# Altium project single channel esc.PrjPcb
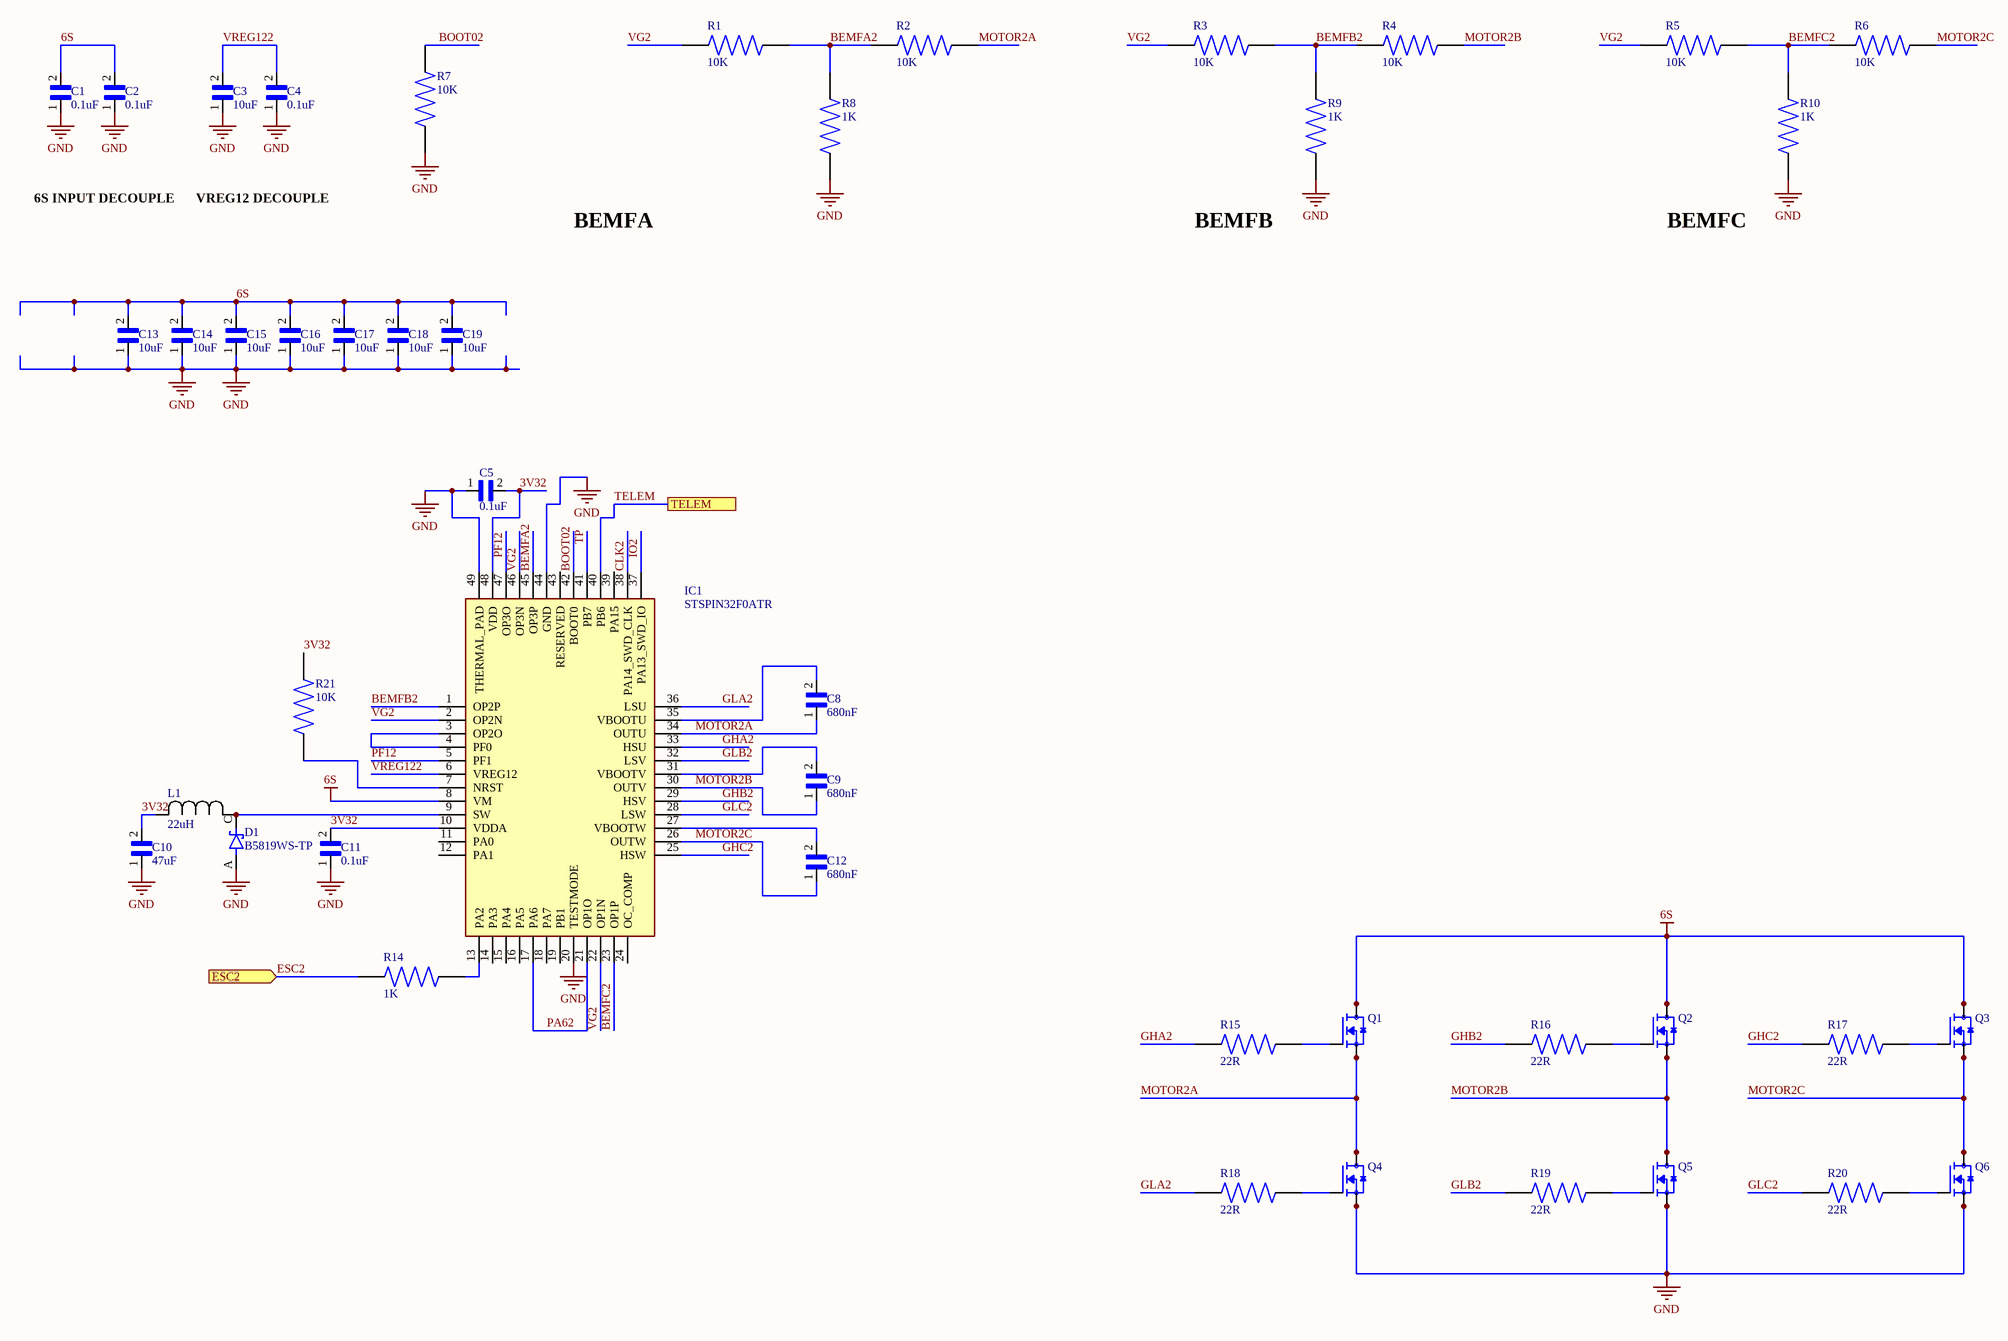
[diagram p0: single esc.SchDoc]
1 sheet, 44 parts. Net scope: flat (ports and power ports of the same name join across sheets).
Board file: single channel esc.PcbDoc

## Sheet single esc.SchDoc
size A2

### Parts
C1  0.1uF  [CAPC1005X55N]
C2  0.1uF  [CAPC1005X55N]
C3  10uF  [CAPC1608X90N]
C4  0.1uF  [CAPC1005X55N]
C5  0.1uF  [CAPC1005X55N]
C8  680nF  [CAPC1005X55N]
C9  680nF  [CAPC1005X55N]
C10  47uF  [CAPC1608X90N]
C11  0.1uF  [CAPC1005X55N]
C12  680nF  [CAPC1005X55N]
C13  10uF  [CAPC3216X190N]
C14  10uF  [CAPC3216X190N]
C15  10uF  [CAPC3216X190N]
C16  10uF  [CAPC3216X190N]
C17  10uF  [CAPC3216X190N]
C18  10uF  [CAPC3216X190N]
C19  10uF  [CAPC3216X190N]
D1  B5819WS-TP  [SOD2512X115N]
IC1  STSPIN32F0ATR  [QFN50P700X700X100-49N-D]
L1  22uH  [IND_BOURNS_SRN3015]
Q1  TPHR8504PL,L1Q  [TRANS_TPHR8504PL,L1Q]  (value not drawn)
Q2  TPHR8504PL,L1Q  [TRANS_TPHR8504PL,L1Q]  (value not drawn)
Q3  TPHR8504PL,L1Q  [TRANS_TPHR8504PL,L1Q]  (value not drawn)
Q4  TPHR8504PL,L1Q  [TRANS_TPHR8504PL,L1Q]  (value not drawn)
Q5  TPHR8504PL,L1Q  [TRANS_TPHR8504PL,L1Q]  (value not drawn)
Q6  TPHR8504PL,L1Q  [TRANS_TPHR8504PL,L1Q]  (value not drawn)
R1  10K  [RESC1005X37N]
R2  10K  [RESC1005X37N]
R3  10K  [RESC1005X37N]
R4  10K  [RESC1005X37N]
R5  10K  [RESC1005X37N]
R6  10K  [RESC1005X37N]
R7  10K  [RESC1005X37N]
R8  1K  [RESC1005X37N]
R9  1K  [RESC1005X37N]
R10  1K  [RESC1005X37N]
R14  1K  [RESC1005X37N]
R15  22R  [RESC1005X37N]
R16  22R  [RESC1005X37N]
R17  22R  [RESC1005X37N]
R18  22R  [RESC1005X37N]
R19  22R  [RESC1005X37N]
R20  22R  [RESC1005X37N]
R21  10K  [RESC1005X37N]

### Ports
ESC2 (in), TELEM

### Nets
6S: C1.2 C2.2 C13.2 C14.2 C15.2 C16.2 C17.2 C18.2 C19.2 IC1.8(VM) Q1.5(D) Q1.6(D) Q1.7(D) Q1.8(D) Q1.9(D) Q2.5(D) Q2.6(D) Q2.7(D) Q2.8(D) Q2.9(D) Q3.5(D) Q3.6(D) Q3.7(D) Q3.8(D) Q3.9(D)
GND: C1.1 C2.1 C3.1 C4.1 C5.1 C10.1 C11.1 C13.1 C14.1 C15.1 C16.1 C17.1 C18.1 C19.1 D1.A IC1.20(TESTMODE) IC1.44(GND) IC1.49(THERMAL_PAD) Q4.1(S) Q4.2(S) Q4.3(S) Q5.1(S) Q5.2(S) Q5.3(S) Q6.1(S) Q6.2(S) Q6.3(S) R7.1 R8.2 R9.2 R10.2
3V32: C5.2 C10.2 C11.2 IC1.10(VDDA) IC1.48(VDD) L1.2 R21.2
BEMFA2: IC1.45(OP3P) R1.1 R2.2 R8.1
BEMFB2: IC1.1(OP2P) R3.1 R4.2 R9.1
BEMFC2: IC1.23(OP1P) R5.1 R6.2 R10.1
BOOT02: IC1.42(BOOT0) R7.2
CLK2: IC1.38(PA14_SWD_CLK)
ESC2: R14.1 ; port ESC2
GHA2: IC1.33(HSU) R15.2
GHB2: IC1.29(HSV) R16.2
GHC2: IC1.25(HSW) R17.2
GLA2: IC1.36(LSU) R18.2
GLB2: IC1.32(LSV) R19.2
GLC2: IC1.28(LSW) R20.2
IO2: IC1.37(PA13_SWD_IO)
MOTOR2A: C8.1 IC1.34(OUTU) Q1.1(S) Q1.2(S) Q1.3(S) Q4.5(D) Q4.6(D) Q4.7(D) Q4.8(D) Q4.9(D) R2.1
MOTOR2B: C9.1 IC1.30(OUTV) Q2.1(S) Q2.2(S) Q2.3(S) Q5.5(D) Q5.6(D) Q5.7(D) Q5.8(D) Q5.9(D) R4.1
MOTOR2C: C12.1 IC1.26(OUTW) Q3.1(S) Q3.2(S) Q3.3(S) Q6.5(D) Q6.6(D) Q6.7(D) Q6.8(D) Q6.9(D) R6.1
PA62: IC1.17(PA6) IC1.21(OP1O)
PF12: IC1.5(PF1) IC1.47(OP3O)
TELEM: IC1.40(PB6) ; port TELEM
TP: IC1.41(PB7)
VG2: IC1.2(OP2N) IC1.22(OP1N) IC1.46(OP3N) R1.2 R3.2 R5.2
VREG122: C3.2 C4.2 IC1.6(VREG12)
NetC8_2: C8.2 IC1.35(VBOOTU)
NetC9_2: C9.2 IC1.31(VBOOTV)
NetC12_2: C12.2 IC1.27(VBOOTW)
NetD1_C: D1.C(K) IC1.9(SW) L1.1
NetIC1_3: IC1.3(OP2O) IC1.4(PF0)
NetIC1_7: IC1.7(NRST) R21.1
NetIC1_13: IC1.13(PA2) R14.2
NetQ1_4: Q1.4(G) R15.1
NetQ2_4: Q2.4(G) R16.1
NetQ3_4: Q3.4(G) R17.1
NetQ4_4: Q4.4(G) R18.1
NetQ5_4: Q5.4(G) R19.1
NetQ6_4: Q6.4(G) R20.1

Not connected (* = marked no-connect by the designer): IC1 11(PA0) 12(PA1) 14(PA3) 15(PA4) 16(PA5) 18(PA7) 19(PB1) 24(OC_COMP) 39(PA15) 43(RESERVED)

### Notes on the sheet
- 6S INPUT DECOUPLE
- VREG12 DECOUPLE
- BEMFA
- BEMFB
- BEMFC

### Library data of the parts
C1 C2 C4 C5 C8 C9 C11 C12 = GRM1555C1H222JA01D: Package: None; Price: None; Value: *; MP: GRM1555C1H222JA01D; Availability: Unavailable
C3 C10 = GRM188R71E224JA88D: SMD Capacitor X7R(EIA) with Capacitance: 0.22uF Tol. 5%. Rated Voltage: 25Vdc; Package: None; Price: None; Value: *; MP: GRM188R71E224JA88D; Availability: Unavailable
C13-C19 = GRM31CC80G227ME11K: Ceramic Capacitor; Package: None; Price: None; Value: *; MP: GRM31CC80G227ME11K; Availability: Unavailable
D1 = B5819WS-TP: MF: {'manufacturer': u'Micro Commercial Components'}; Package: None; MP: B5819WS-TP; Price: None; Availability: Unavailable; Value: *
IC1 = STSPIN32F0ATR: Integrated Circuit; Manufacturer_Name: STMicroelectronics; Datasheet Link: http://www.st.com/content/ccc/resource/technical/document/datasheet/group3/3d/88/0f/d1/3f/0c/49/80/DM00406030/files/DM00406030.pdf/jcr:content/translations/en.DM00406030.pdf; Height: 1mm; Manufacturer_Part_Number: STSPIN32F0ATR; Mouser Part Number: 511-STSPIN32F0ATR; Mouser Price/Stock: https://www.mouser.co.uk/ProductDetail/STMicroelectronics/STSPIN32F0ATR?qs=1mbolxNpo8flc7yUpKWOVQ%3D%3D; Arrow Part Number: STSPIN32F0ATR; Arrow Price/Stock: https://www.arrow.com/en/products/stspin32f0atr/stmicroelectronics
L1 = SRN3015-220M: No Description Available; Mfr_Name: Bourns Electronics; Type: DEV; Copyright: Copyright (C) 2022 Ultra Librarian. All rights reserved.; Manufacturer_Part_Number: SRN3015-220M; Digi-Key_Part_Number_1: SRN3015-220MCT-ND; Digi-Key_Part_Number_2: SRN3015-220MDKR-ND; Digi-Key_Part_Number_3: SRN3015-220MTR-ND; RefDes: RefDes
Q1-Q6 = TPHR8504PL,L1Q: N-Channel 40V 150A (Tc) 1W (Ta), 170W (Tc) Surface Mount 8-SOP Advance (5x5); MF: Toshiba Semiconductor; Package: SOP-8 Toshiba; Price: None; Value: *; MP: TPHR8504PL,L1Q; SnapEDA_Link: https://www.snapeda.com/parts/TPHR8504PL,L1Q/Toshiba%20Semiconductor%20and%20Storage/view-part/604439/?ref=snap; Availability: Unavailable
R1-R10 R14-R21 = RE0402BRE07330KL: MF: {'manufacturer': u'Yageo'}; Availability: Unavailable; Package: None; MP: RE0402BRE07330KL; Value: *; Price: None